# Altium schematic sheet output_filter_LC.SchDoc
size A4
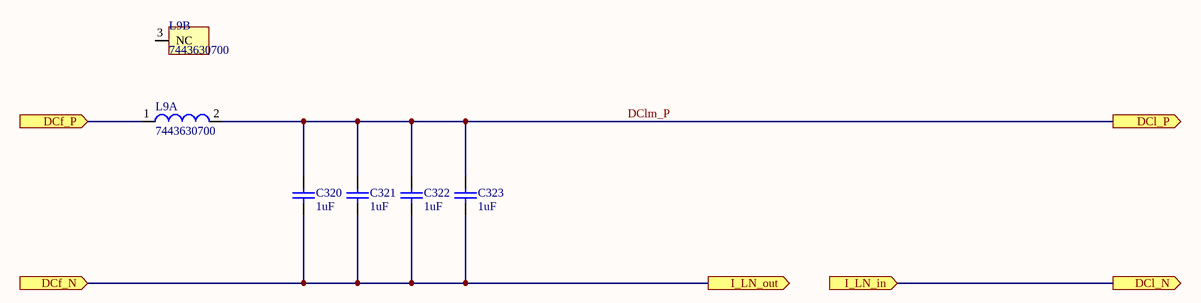
[diagram p0: output_filter_LC.SchDoc]

## Parts
C320  value 1uF  [CAPC2225(5664)230_L]  (hidden comment: CAP 1uF 200V 2225(5664))
C321  value 1uF  [CAPC2225(5664)230_L]  (hidden comment: CAP 1uF 200V 2225(5664))
C322  value 1uF  [CAPC2225(5664)230_L]  (hidden comment: CAP 1uF 200V 2225(5664))
C323  value 1uF  [CAPC2225(5664)230_L]  (hidden comment: CAP 1uF 200V 2225(5664))
L9  7443630700  [WE-HCF-2013]  (parts A,B of 2)

## Ports
DCf_N (in), DCf_P (in), DCl_N (out), DCl_P (out), I_LN_in (in), I_LN_out (out)

## Nets
DCf_N: C320.1 C321.1 C322.1 C323.1 ; port DCf_N, port I_LN_out
DCf_P: L9.1 ; port DCf_P
DCl_N: port DCl_N, port I_LN_in
DClm_P: C320.2 C321.2 C322.2 C323.2 L9.2 ; port DCl_P

Not connected (* = marked no-connect by the designer): L9 3(NC)

## Library data of the parts
C320-C323 = CMP-1043-00930-1: CAP 1uF 200V ±10% 2225 (5664 Metric) Thickness 2.2mm SMD; Case-EIA: 2225; Tolerance: Â±10%; Case-Metric: 5664; Max Thickness: 2.2 mm; Rated Voltage: 200 V; Technology: SMT
L9 = CMP-0226-00161-1: SMD High Current Inductor WE-HCF, L=7.00 µH; Inductance: 7.00 ÂµH; ComponentLink1URL: http://www.we-online.com; PackageDescription: SMD Inductor, 3-Leads, Body 21.5 x 21.0 mm; ComponentLink1Description: Manufacturer Link; ComponentLink2Description: Datasheet; DatasheetVersion: ver 1, Jul-2009; PackageReference: WE-HCF-2013; PackageVersion: 2009; ComponentLink2URL: http://www.we-online.de/katalog/media/pdf/7443630700.pdf